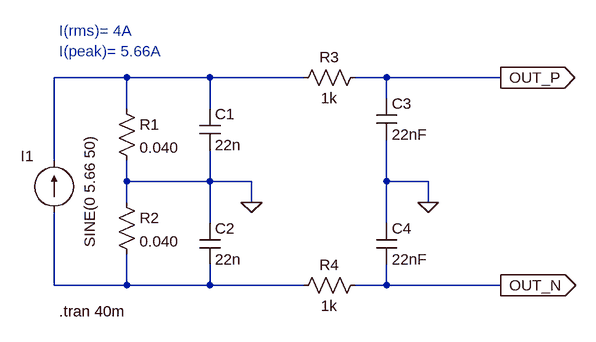
[diagram p0: schematic v1.0.asc]
v1.0.asc, the LTspice schematic file:
Version 4.1
SHEET 1 1100 680
WIRE 256 32 144 32
WIRE 384 32 256 32
WIRE 528 32 384 32
WIRE 656 32 608 32
WIRE 832 32 656 32
WIRE 656 64 656 32
WIRE 256 80 256 32
WIRE 384 80 384 32
WIRE 144 160 144 32
WIRE 256 192 256 160
WIRE 384 192 384 144
WIRE 384 192 256 192
WIRE 448 192 384 192
WIRE 656 192 656 128
WIRE 720 192 656 192
WIRE 256 224 256 192
WIRE 448 224 448 192
WIRE 720 224 720 192
WIRE 384 256 384 192
WIRE 656 256 656 192
WIRE 144 352 144 240
WIRE 256 352 256 304
WIRE 256 352 144 352
WIRE 384 352 384 320
WIRE 384 352 256 352
WIRE 528 352 384 352
WIRE 656 352 656 320
WIRE 656 352 608 352
WIRE 832 352 656 352
FLAG 448 224 0
FLAG 720 224 0
FLAG 832 32 OUT_P
IOPIN 832 32 Out
FLAG 832 352 OUT_N
IOPIN 832 352 Out
SYMBOL current 144 240 R180
WINDOW 0 31 87 Left 2
WINDOW 3 -55 -54 VRight 2
WINDOW 123 0 0 Left 0
WINDOW 39 0 0 Left 0
SYMATTR InstName I1
SYMATTR Value SINE(0 5.66 50)
SYMBOL res 240 64 R0
SYMATTR InstName R1
SYMATTR Value 0.040
SYMBOL res 240 208 R0
SYMATTR InstName R2
SYMATTR Value 0.040
SYMBOL cap 368 80 R0
SYMATTR InstName C1
SYMATTR Value 22n
SYMBOL cap 368 256 R0
SYMATTR InstName C2
SYMATTR Value 22n
SYMBOL res 624 16 R90
WINDOW 0 0 56 VBottom 2
WINDOW 3 32 56 VTop 2
SYMATTR InstName R3
SYMATTR Value 1k
SYMBOL res 624 336 R90
WINDOW 0 0 56 VBottom 2
WINDOW 3 32 56 VTop 2
SYMATTR InstName R4
SYMATTR Value 1k
SYMBOL cap 640 64 R0
SYMATTR InstName C3
SYMATTR Value 22nF
SYMBOL cap 640 256 R0
SYMATTR InstName C4
SYMATTR Value 22nF
TEXT 152 392 Left 2 !.tran 40m
TEXT 152 -40 Left 2 ;I(rms)= 4A\nI(peak)= 5.66A

The netlist it stands for:
* v1.0.asc
I1 N002 N001 SINE(0 5.66 50)
R1 N001 0 0.040
R2 0 N002 0.040
C1 N001 0 22n
C2 0 N002 22n
R3 OUT_P N001 1k
R4 OUT_N N002 1k
C3 OUT_P 0 22nF
C4 0 OUT_N 22nF
.tran 40m
* I(rms)= 4A
* I(peak)= 5.66A
.backanno
.end

* Results of the author's LTspice run, read from the files saved beside the schematic
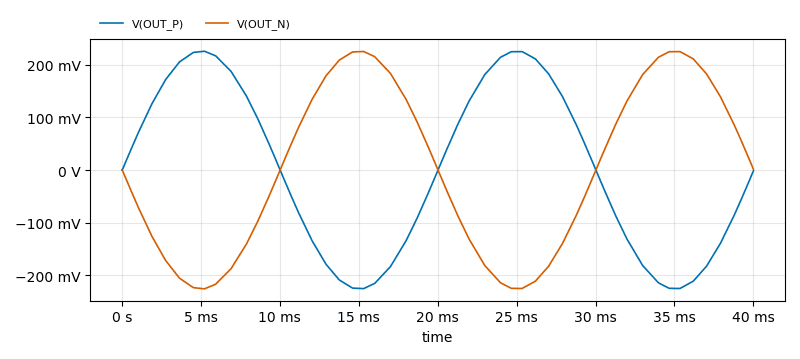
[diagram p1: Transient Analysis of v1.0.asc, plotted from the saved traces]
* Transient Analysis, 1 run:
*   V(OUT_P): min -225.5 mV, max 225.9 mV, average -925.9 nV, rms 159.8 mV, last -1.565 mV
*   V(OUT_N): min -225.9 mV, max 225.5 mV, average 925.9 nV, rms 159.8 mV, last 1.565 mV